# Altium schematic sheet CONECTORES.SchDoc
size A4
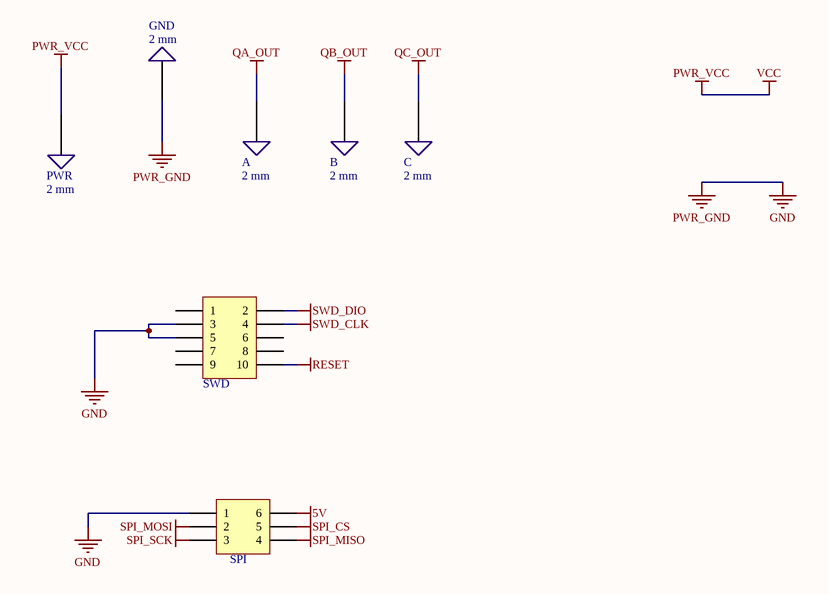
[diagram p0: CONECTORES.SchDoc]

## Parts
A  2 mm  [HOLE_2mm]  (no BOM)
B  2 mm  [HOLE_2mm]  (no BOM)
C  2 mm  [HOLE_2mm]  (no BOM)
GND  2 mm  [HOLE_2mm]  (no BOM)
PWR  2 mm  [HOLE_2mm]  (no BOM)
SPI  Header 3X2  [Pines 2X3]  (value not drawn)
SWD  HEADER-5x2S  [G-HEADER_5x2I.05P_SM]  (value not drawn)

## Nets
5V: SPI.6
GND: GND.1(Wire) SPI.1 SWD.3 SWD.5  [also labelled PWR_GND]
PWR_VCC: PWR.1(Wire)  [also labelled VCC]
QA_OUT: A.1(Wire)
QB_OUT: B.1(Wire)
QC_OUT: C.1(Wire)
RESET: SWD.10
SPI_CS: SPI.5
SPI_MISO: SPI.4
SPI_MOSI: SPI.2
SPI_SCK: SPI.3
SWD_CLK: SWD.4
SWD_DIO: SWD.2

Not connected (* = marked no-connect by the designer): SWD 1 6 7 8 9

## Notes on the sheet
- Title
- Size:
- Date:
- A4
- Number:
- Time:
- Revision:
- Sheet
- of
- File:
- Drawn by:

## Library data of the parts
A B C GND PWR = SOLDERED_WIRE_2mm: Pad to solder wire; Name: SOLDERED_WIRE_2mm; Value: 2 mm
SPI = Header 3X2: Header, 3-Pin, Dual row; LatestRevisionDate: 17-Jul-2002; LatestRevisionNote: Re-released for DXP Platform.; Publisher: Altium Limited
SWD = HEADER_5x2_50mil_U: CONN HEADER 10POS DL UNSHRD SMD; Name: HEADER_5x2_50mil_U